# Altium schematic sheet CDCDCDC_12V.SchDoc
size A4
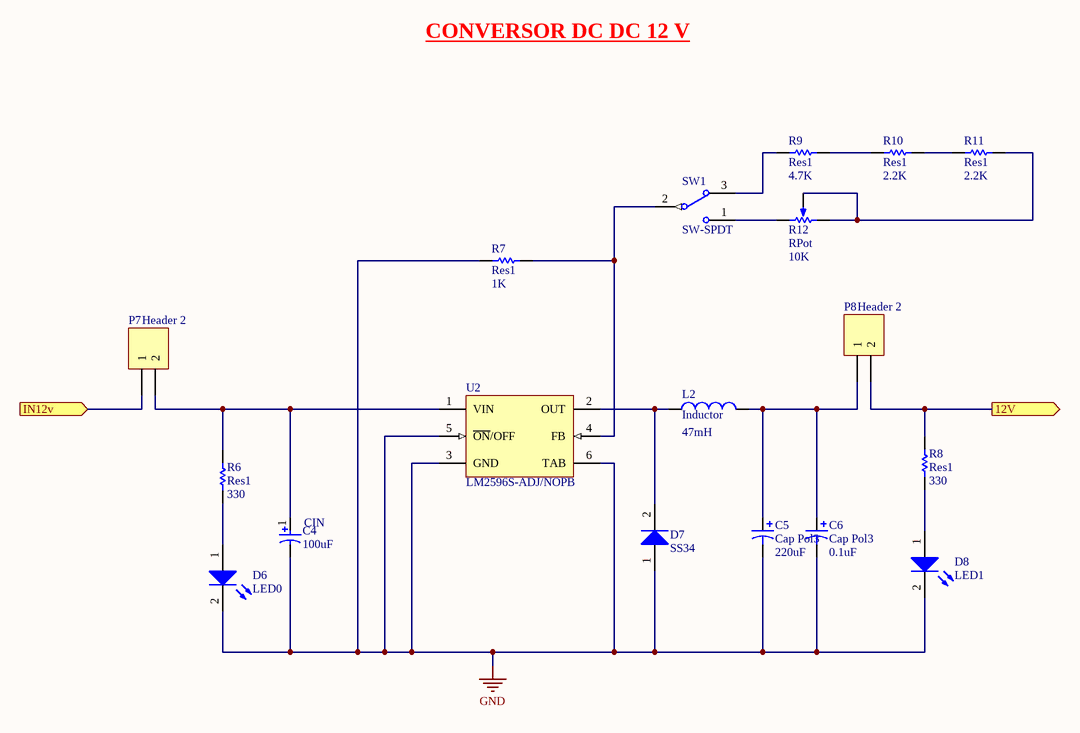
[diagram p0: CDCDCDC_12V.SchDoc]

## Parts
C4  100uF  [NIC-UWT1H101MNL1GS_N]
C5  Cap Pol3  value 220uF  [1812]
C6  Cap Pol3  value 0.1uF  [1812]
D6  LED0  [LED-0]
D7  SS34  [SMC]
D8  LED1  [LED-0]
L2  Inductor  value 47mH  [0402-A]
P7  Header 2  [HDR1X2]
P8  Header 2  [HDR1X2]
R6  Res1  value 330  [AXIAL-0.3]
R7  Res1  value 1K  [AXIAL-0.3]
R8  Res1  value 330  [AXIAL-0.3]
R9  Res1  value 4.7K  [AXIAL-0.3]
R10  Res1  value 2.2K  [AXIAL-0.3]
R11  Res1  value 2.2K  [AXIAL-0.3]
R12  RPot  value 10K  [VR5]
SW1  SW-SPDT  [TL36WW15050]
U2  LM2596S-ADJ/NOPB  [KTT0005B_N]

## Ports
12V (out), IN12v (in)

## Nets
GND: C4.2 C5.2 C6.2 D6.2(K) D7.1(A) D8.2(K) R7.2 U2.3(GND) U2.5(~{ON}/OFF) U2.6(TAB)
12V: P8.2 R8.2 ; port 12V
IN12v: P7.1 ; port IN12v
NetC4_1: C4.1 P7.2 R6.2 U2.1(VIN)
NetC5_1: C5.1 C6.1 L2.2 P8.1
NetD6_1: D6.1(A) R6.1
NetD7_2: D7.2(K) L2.1 U2.2(OUT)
NetD8_1: D8.1(A) R8.1
NetR7_1: R7.1 SW1.2 U2.4(FB)
NetR9_1: R9.1 R10.2
NetR9_2: R9.2 SW1.3
NetR10_1: R10.1 R11.2
NetR11_1: R11.1 R12.1(TOP) R12.3(TAP)
NetR12_2: R12.2(BOT) SW1.1

## Notes on the sheet
- CONVERSOR DC DC 12 V
- (near C4) CIN

## Library data of the parts
C4 = CMP-2000-07373-1: Aluminum Electrolytic Capacitor, 100 uF, +/- 20%, 50 V, -55 to 105 degC, 2-Pin SMD, RoHS, Tape and Reel; Manufacturer: Nichicon; Capacitance: 100µF; Type: Can; Rated Voltage: 50V; Datasheet Version: 08/2015; Operating Temp-Max: 105°C; Mounting Technology: SurfaceMount; Datasheet URL: http://products.nichicon.co.jp/en/pdf/XJA043/e-uwt.pdf; Package Description: Aluminum Electrolytic Capacitor, Body 8.3 x 8.3 mm, Height 10.8 mm; Package Reference: UWT1H101MNL1GS; Case Size/Dimension: Ø8x10mm; Manufacturer URL: http://www.nichicon.co.jp/english/
C5 C6 = Cap Pol3: Polarized Capacitor (Surface Mount); Published: 8-Jun-2000; LatestRevisionDate: 29-May-2009; LatestRevisionNote: IPC-7351 Footprint Added.; PackageReference: C0805; Publisher: Altium Limited; PackageDescription: Chip Capacitor
D6 D8 = LED0: Typical INFRARED GaAs LED; Published: 8-Jun-2000; LatestRevisionDate: 08-Jul-2005; LatestRevisionNote: Mech Layer 1 removed.; PackageReference: LED-0; Publisher: Altium Limited; PackageDescription: LED; 2 Leads
D7 = Diode: Default Diode; Published: 8-Jun-2000; LatestRevisionDate: 17-Jul-2002; LatestRevisionNote: Re-released for DXP Platform.; PackageVersion: Sep-1996; PackageReference: SMC; Publisher: Altium Limited; PackageDescription: DO-214-AB/SMC; 2 C-Bend Leads; Body 7.9 x 5.9 mm, inc. leads (LxW); Code_JEDEC: DO-214-AB
L2 = Inductor: Code_IEC: 1005; Published: 8-Jun-2000; LatestRevisionDate: 29-May-2009; LatestRevisionNote: IPC-7351 Footprint Added.; PackageReference: 0402-A; Publisher: Altium Limited; PackageDescription: Chip Inductor; Code_JEITA: 0402
P7 P8 = Header 2: Header, 2-Pin; LatestRevisionDate: 17-Jul-2002; LatestRevisionNote: Re-released for DXP Platform.; Publisher: Altium Limited
R6-R11 = Res1: Resistor; Published: 8-Jun-2000; LatestRevisionDate: 17-Jul-2002; LatestRevisionNote: Re-released for DXP Platform.; PackageReference: AXIAL-0.3; Publisher: Altium Limited; PackageDescription: Axial Device, Thru-Hole; 2 Leads; 0.3 in Pin Spacing
R12 = RPot: Potentiometer; Sim Note: Enter the Resistance value and the set point into parameter fields.; Set Position: 0.5; Published: 8-Jun-2000; LatestRevisionDate: 17-Jul-2002; LatestRevisionNote: Re-released for DXP Platform.; PackageReference: VR5; Publisher: Altium Limited; PackageDescription: Variable Resistor, Thru-Hole; 3 Leads
SW1 = SW-SPDT: SPDT Subminiature Toggle Switch, Right Angle Mounting, Vertical Actuation; Published: 24-Mar-1999; LatestRevisionDate: 17-Dec-2003; LatestRevisionNote: Schematic revised, PCB Footprint replaced.; DatasheetVersion: 05-Dec-2000; PackageReference: TL36WW15050; Publisher: Altium Limited; PackageDescription: Switch; 4 Leads; ComponentLink1Description: Manufacturer Link; ComponentLink1URL: http://www.apem.com
U2 = CMP-0069-00271-3: SIMPLE SWITCHER® Power Converter 150 KHz 3A Step-Down Voltage Regulator, 5-pin TO-263, Pb-Free; Manufacturer: Texas Instruments; PowerWise: N; PackageTopMarking: NSUZXYTTE#*LM2596S*-ADJ P+; ComponentLink1Description: Datasheet URL; PackageDescription: TO-263, Molded, .400 x .390 x .180in, 5 Lead, .067in Pitch, Surface Mount; ComponentLink1URL: http://www.ti.com/general/docs/lit/getliterature.tsp?genericPartNumber=LM2596&fileType=pdf; Code_JEDEC: MO-169-AB; PinCount: 5; CompType: Switcher; PackageReference: KTT0005B; RoHS: Y